# Altium schematic sheet SuperClock_Core_PWR.SchDoc
size A4; Organization: Altium Limited; Address1: L3, 12a Rodborough Rd; Address2: Frenchs Forest; Address3: NSW; Address4: Australia 2086
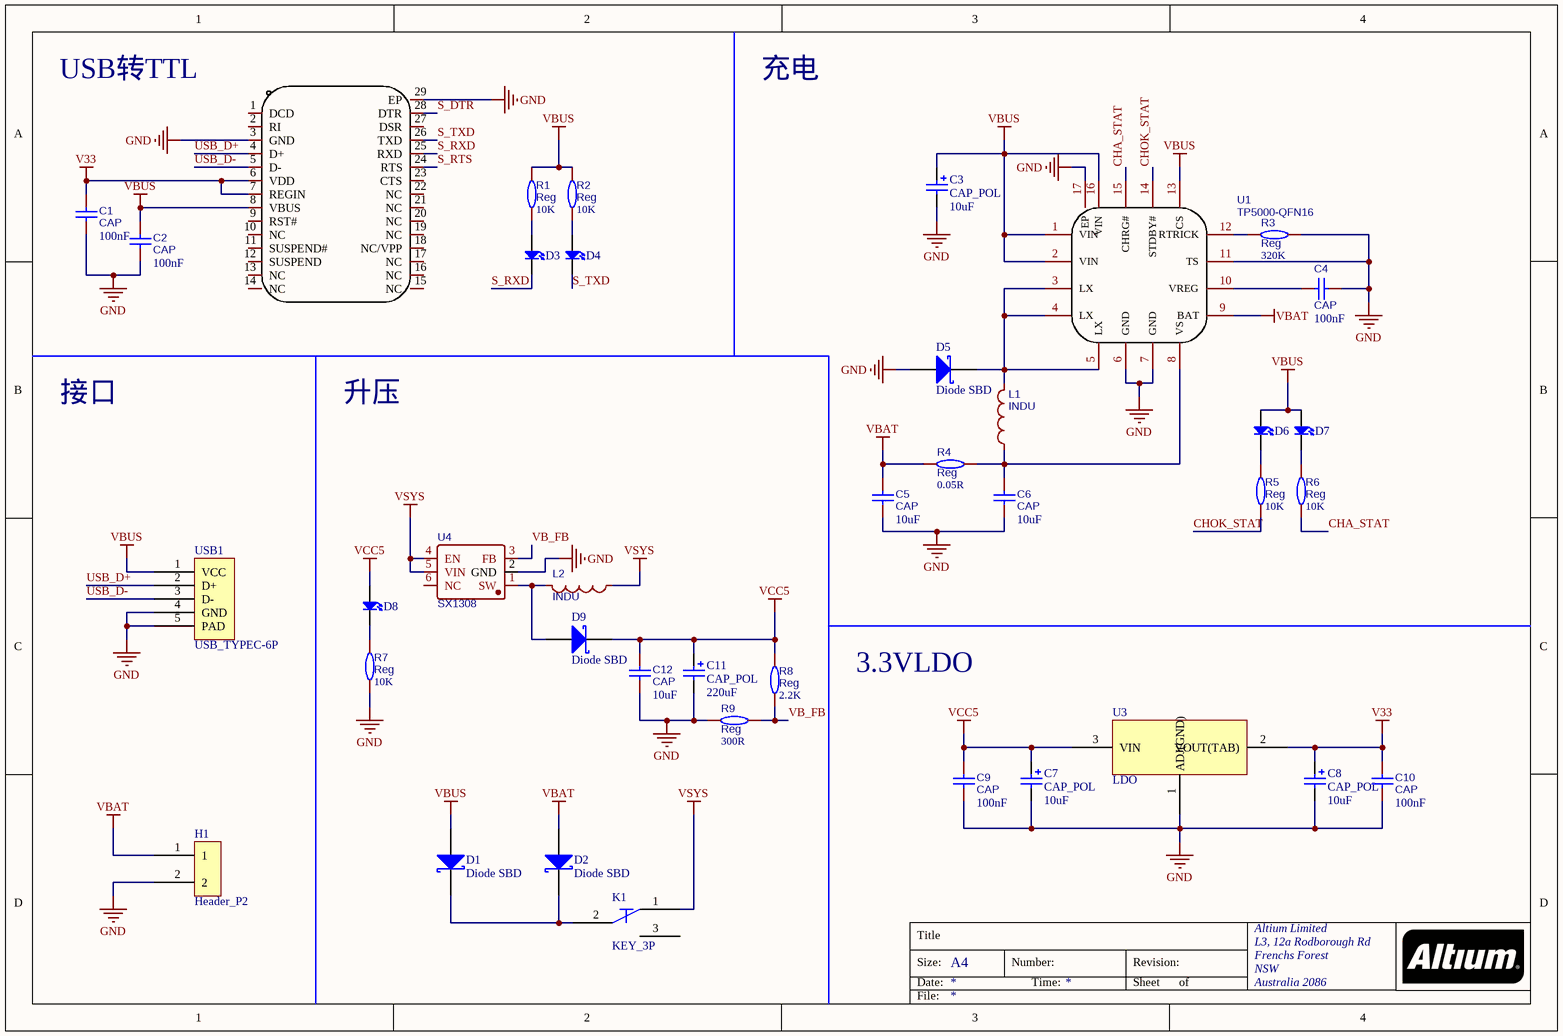
[diagram p0: SuperClock_Core_PWR.SchDoc]

## Parts
C1  CAP  value 100nF  [C0603]
C2  CAP  value 100nF  [C0603]
C3  CAP_POL  value 10uF  [CP1206]
C4  CAP  value 100nF  [C0603]
C5  CAP  value 10uF  [C0603]
C6  CAP  value 10uF  [C0603]
C7  CAP_POL  value 10uF  [CP1206]
C8  CAP_POL  value 10uF  [CP1206]
C9  CAP  value 100nF  [C0603]
C10  CAP  value 100nF  [C0603]
C11  CAP_POL  value 220uF  [CAP_SMD_6.3mm]
C12  CAP  value 10uF  [C0603]
D1  Diode SBD  [SMA_L4.3]
D2  Diode SBD  [SMA_L4.3]
D3  LED  [LED0603]  (value not drawn)
D4  LED  [LED0603]  (value not drawn)
D5  Diode SBD  [SMA_L4.3]
D6  LED  [LED0603]  (value not drawn)
D7  LED  [LED0603]  (value not drawn)
D8  LED  [LED0603]  (value not drawn)
D9  Diode SBD  [SMA_L4.3]
H1  Header_P2  [PH_2Pin]
K1  KEY_3P  [SWITCH_3P_2]
L1  INDU  [SMD_L7.1]
L2  INDU  [SMD_L7.1]
R1  Reg  value 10K  [R0603]
R2  Reg  value 10K  [R0603]
R3  Reg  value 320K  [R0603]
R4  Reg  value 0.05R  [R1206]
R5  Reg  value 10K  [R0603]
R6  Reg  value 10K  [R0603]
R7  Reg  value 10K  [R0603]
R8  Reg  value 2.2K  [R0603]
R9  Reg  value 300R  [R0603]
U1  TP5000-QFN16  [QFN-16_L4.0-W4.0-P0.65-BL-EP2.2]
U2  CP2102-GM  [QFN-28]  (value not drawn)
U3  LDO  [SOT-223]
U4  SX1308  [SOT-23-6]
USB1  USB_TYPEC-6P  [USB_TYPEC]

## Nets
GND: C1.2 C2.2 C3.2 C4.2 C5.2 C6.2 C7.2 C8.2 C9.2 C10.2 C11.2 C12.2 D5.2(A) H1.2 R3.2 R7.1 R9.2 U1.6(GND) U1.7(GND) U1.11(TS) U1.17(EP) U2.3(GND) U2.29(EP) U3.1(ADJ(GND)) U4.2(GND) USB1.4(GND) USB1.5(PAD)
V33: C1.1 C8.1 C10.1 U2.6(VDD) U2.7(REGIN) U3.2(VOUT(TAB))
VBAT: C5.1 D2.2(A) H1.1 R4.1 U1.9(BAT)
VBUS: C2.1 C3.1 D1.2(A) D6.2(A) D7.2(A) R1.2 R2.2 U1.1(VIN) U1.2(VIN) U1.13(CS) U1.16(VIN) U2.8(VBUS) USB1.1(VCC)
VCC5: C7.1 C9.1 C11.1 C12.1 D8.2(A) D9.1(K) R8.2 U3.3(VIN)
VSYS: K1.1 L2.1 U4.4(EN) U4.5(VIN)
CHA_STAT: R6.1 U1.15(CHRG#)
CHOK_STAT: R5.1 U1.14(STDBY#)
S_DTR: U2.28(DTR)
S_RTS: U2.24(RTS)
S_RXD: D3.1(K) U2.25(RXD)
S_TXD: D4.1(K) U2.26(TXD)
USB_D+: U2.4(D+) USB1.2(D+)
USB_D-: U2.5(D-) USB1.3(D-)
VB_FB: R8.1 R9.1 U4.3(FB)
NetC4_1: C4.1 U1.10(VREG)
NetC6_1: C6.1 L1.1 R4.2 U1.8(VS)
NetD1_1: D1.1(K) D2.1(K) K1.2
NetD3_2: D3.2(A) R1.1
NetD4_2: D4.2(A) R2.1
NetD5_1: D5.1(K) L1.2 U1.3(LX) U1.4(LX) U1.5(LX)
NetD6_1: D6.1(K) R5.2
NetD7_1: D7.1(K) R6.2
NetD8_1: D8.1(K) R7.2
NetD9_2: D9.2(A) L2.2 U4.1(SW)
NetR3_1: R3.1 U1.12(RTRICK)

Not connected (* = marked no-connect by the designer): K1 3; U2 1(DCD) 2(RI) 9(RST#) 10(NC) 11(SUSPEND#) 12(SUSPEND) 13(NC) 14(NC) 15(NC) 16(NC) 17(NC) 18(NC/VPP) 19(NC) 20(NC) 21(NC) 22(NC) 23(CTS) 27(DSR); U4 6(NC)

## Notes on the sheet
- USB转TTL
- 充电
- 接口
- 升压
- 3.3VLDO
- Title
- Size:
- Date:
- A4
- Number:
- Time:
- Revision:
- Sheet
- of
- File:

## Library data of the parts
C1 C2 C4-C6 C9 C10 C12 = CAP: BOM_Manufacturer: Huaxin S&T; BOM_Manufacturer Part: 0603B103K101CT; nameAlias: Capacitance; Contributor: LCSC; BOM_Supplier: LCSC; BOM_Supplier Part: C302008; spicePre: C; spiceSymbolName: 0603B103K101CT
C3 C7 C8 C11 = CAP_POL: 极性电容
D1 D2 D5 D9 = Diode SBD: Schottky Rectifier; Note: Terminal 2 is the TAB and is electrically connected to the cathode; Published: 8-Jun-2000; LatestRevisionDate: 17-Jul-2002; LatestRevisionNote: Re-released for DXP Platform.; DatasheetVersion: PD-2.057B; PackageVersion: Feb-1998; PackageReference: TO-220AC; Publisher: Altium Limited; PackageDescription: TO, Thru-Hole, Vertical, Heatsink Mounted; 3 In-Line Leads (1 Absent); Pitch 2.54 mm; ComponentLink1Description: Manufacturer Link; ComponentLink1URL: http://www.irf.com/; ComponentLink2Description: Datasheet; ComponentLink2URL: http://www.irf.com/product-info/datasheets/data/10tq.pdf
D3 D4 D6-D8 = LED0: Published: 8-Jun-2000; LatestRevisionDate: 08-Jul-2005; LatestRevisionNote: Mech Layer 1 removed.; PackageReference: LED-0; Publisher: Altium Limited; PackageDescription: LED; 2 Leads
H1 = Header_P2: 2Pin排针
K1 = KEY_3P: 3Pin按键
L1 L2 = IND: 电感; BOM_Manufacturer: Sunltech Tech; BOM_Manufacturer Part: SLO0630H150MTT; nameAlias: Inductance; Contributor: LCSC; BOM_Supplier: LCSC; BOM_Supplier Part: C182182; BOM_JLCPCB Part Class: Extended Part; spicePre: L; spiceSymbolName: SLO0630H150MTT; Value: *
R1-R9 = Res: 电阻; BOM_Manufacturer: Viking Tech; BOM_Manufacturer Part: AR03BTCX1002A; nameAlias: Resistance (Ohms); Contributor: LCSC; BOM_Supplier: LCSC; BOM_Supplier Part: C465721; spicePre: R; spiceSymbolName: AR03BTCX1002A
U1 = TP5000-QFN16: BOM_Manufacturer: TOPPOWER; BOM_Supplier: LCSC; BOM_Manufacturer Part: TP5000-QFN16; BOM_Supplier Part: C51699; BOM_JLCPCB Part Class: Extended Part; spicePre: U; spiceSymbolName: TP5000-QFN16
U2 = CP2102-GM: CP2102USB转串口; Manufacturer: SILICON LABS(芯科); Add into BOM: yes; Name: CP2102-GM; Symbol: CP2102-GM; Device: CP2102-GM; LCSC Part Name: Silicon Labs-MCU; Supplier Part: C430012; Manufacturer Part: CP2102-GM; Supplier Footprint: QFN-28; JLCPCB Part Class: Extended Part; Datasheet: https://atta.szlcsc.com/upload/public/pdf/source/20190920/C430012_1BEF61EC258E8DA8CB0C9799CDAE6C98.pdf; Supplier: LCSC; Convert to PCB: yes; Type: -; Protocol: -; Number of Drivers/Receivers: -; Data Rate: -; Supply Voltage: -
U3 = AMS1117
U4 = SX1308: 升压PWM; BOM_Manufacturer: SX; sourceId: g4Yg9rJ1j; timeStamp: 1472247539; BOM_Supplier: LCSC; BOM_Manufacturer Part: SX1308; BOM_Supplier Part: C78162; BOM_JLCPCB Part Class: Extended Part; spicePre: U; spiceSymbolName: SX1308
USB1 = USB_TYPEC